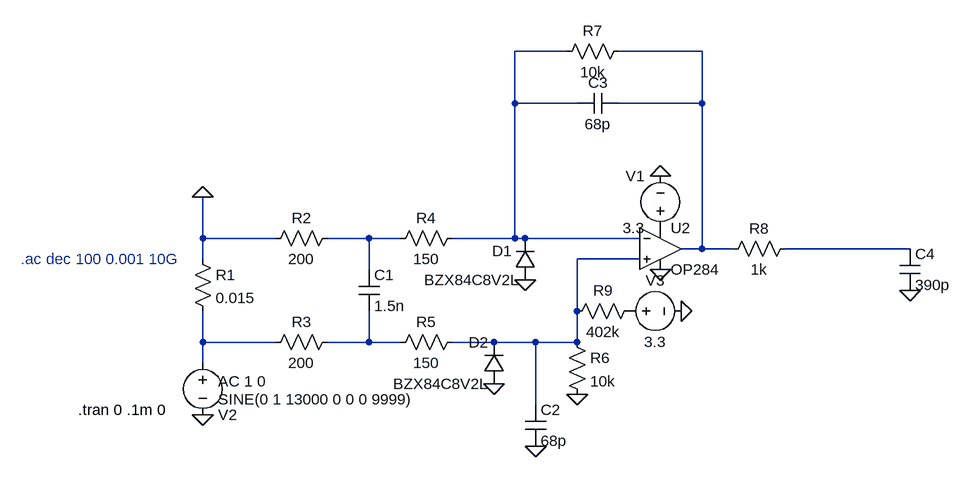
[diagram p0: schematic Current_Sense.asc]
Current_Sense.asc, the LTspice schematic file:
Version 4.1
SHEET 1 1352 680
WIRE 560 -112 480 -112
WIRE 768 -112 640 -112
WIRE 480 -32 480 -112
WIRE 576 -32 480 -32
WIRE 768 -32 768 -112
WIRE 768 -32 640 -32
WIRE 0 176 0 112
WIRE 112 176 0 176
WIRE 256 176 192 176
WIRE 304 176 256 176
WIRE 480 176 480 -32
WIRE 480 176 384 176
WIRE 496 176 480 176
WIRE 672 176 496 176
WIRE 768 192 768 -32
WIRE 768 192 736 192
WIRE 816 192 768 192
WIRE 1088 192 896 192
WIRE 0 208 0 176
WIRE 672 208 576 208
WIRE 256 224 256 176
WIRE 576 288 576 208
WIRE 0 336 0 288
WIRE 112 336 0 336
WIRE 256 336 256 288
WIRE 256 336 192 336
WIRE 304 336 256 336
WIRE 448 336 384 336
WIRE 512 336 448 336
WIRE 576 336 576 288
WIRE 576 336 512 336
WIRE 0 368 0 336
WIRE 512 432 512 336
FLAG 0 112 0
FLAG 0 448 0
FLAG 1088 256 0
FLAG 448 400 0
FLAG 512 496 0
FLAG 576 416 0
FLAG 496 240 0
FLAG 704 224 0
FLAG 704 80 0
FLAG 736 288 0
SYMBOL res -16 192 R0
SYMATTR InstName R1
SYMATTR Value 0.015
SYMBOL res 208 160 R90
WINDOW 0 0 56 VBottom 2
WINDOW 3 32 56 VTop 2
SYMATTR InstName R2
SYMATTR Value 200
SYMBOL res 208 320 R90
WINDOW 0 0 56 VBottom 2
WINDOW 3 32 56 VTop 2
SYMATTR InstName R3
SYMATTR Value 200
SYMBOL res 400 160 R90
WINDOW 0 0 56 VBottom 2
WINDOW 3 32 56 VTop 2
SYMATTR InstName R4
SYMATTR Value 150
SYMBOL res 400 320 R90
WINDOW 0 0 56 VBottom 2
WINDOW 3 32 56 VTop 2
SYMATTR InstName R5
SYMATTR Value 150
SYMBOL cap 240 224 R0
SYMATTR InstName C1
SYMATTR Value 1.5n
SYMBOL diode 512 240 R180
WINDOW 0 36 45 Left 2
WINDOW 3 24 0 Left 2
SYMATTR InstName D1
SYMATTR Value BZX84C8V2L
SYMBOL diode 464 400 R180
WINDOW 0 24 64 Left 2
WINDOW 3 24 0 Left 2
SYMATTR InstName D2
SYMATTR Value BZX84C8V2L
SYMBOL cap 496 432 R0
SYMATTR InstName C2
SYMATTR Value 68p
SYMBOL res 560 320 R0
SYMATTR InstName R6
SYMATTR Value 10k
SYMBOL res 656 -128 R90
WINDOW 0 0 56 VBottom 2
WINDOW 3 32 56 VTop 2
SYMATTR InstName R7
SYMATTR Value 10k
SYMBOL cap 640 -48 R90
WINDOW 0 0 32 VBottom 2
WINDOW 3 32 32 VTop 2
SYMATTR InstName C3
SYMATTR Value 68p
SYMBOL res 912 176 R90
WINDOW 0 0 56 VBottom 2
WINDOW 3 32 56 VTop 2
SYMATTR InstName R8
SYMATTR Value 1k
SYMBOL cap 1072 192 R0
SYMATTR InstName C4
SYMATTR Value 390p
SYMBOL OpAmps\\OP284 704 128 R0
SYMATTR InstName U2
SYMBOL voltage 704 176 R180
WINDOW 0 24 96 Left 2
WINDOW 3 24 16 Left 2
WINDOW 123 0 0 Left 0
WINDOW 39 0 0 Left 0
SYMATTR InstName V1
SYMATTR Value 3.3
SYMBOL voltage 0 352 R0
WINDOW 0 24 96 Left 2
WINDOW 3 24 72 Left 2
WINDOW 123 24 44 Left 2
WINDOW 39 0 0 Left 0
SYMATTR InstName V2
SYMATTR Value SINE(0 1 13000 0 0 0 9999)
SYMATTR Value2 AC 1 0
SYMBOL res 672 272 R90
WINDOW 0 0 56 VBottom 2
WINDOW 3 32 56 VTop 2
SYMATTR InstName R9
SYMATTR Value 402k
SYMBOL voltage 640 288 R270
WINDOW 0 32 56 VTop 2
WINDOW 3 -32 56 VBottom 2
WINDOW 123 0 0 Left 0
WINDOW 39 0 0 Left 0
SYMATTR InstName V3
SYMATTR Value 3.3
TEXT -192 440 Left 2 !.tran 0 .1m 0
TEXT -280 208 Left 2 ;.ac dec 100 0.001 10G

The netlist it stands for:
* Current_Sense.asc
R1 0 N006 0.015
R2 N003 0 200
R3 N007 N006 200
R4 N001 N003 150
R5 N005 N007 150
C1 N003 N007 1.5n
D1 0 N001 BZX84C8V2L
D2 0 N005 BZX84C8V2L
C2 N005 0 68p
R6 N005 0 10k
R7 N002 N001 10k
C3 N002 N001 68p
R8 N004 N002 1k
C4 N004 0 390p
X§U2 N005 N001 P001 0 N002 OP284  ; pins In+ In- V+ V- OUT
V1 P001 0 3.3
V2 N006 0 SINE(0 1 13000 0 0 0 9999) AC 1 0
R9 P002 N005 402k
V3 P002 0 3.3
.model D D
.lib standard.dio
.tran 0 .1m 0
* .ac dec 100 0.001 10G
.lib ADI1.lib
.backanno
.end